# EAGLE schematic board1 (EAGLE 9.0.0)
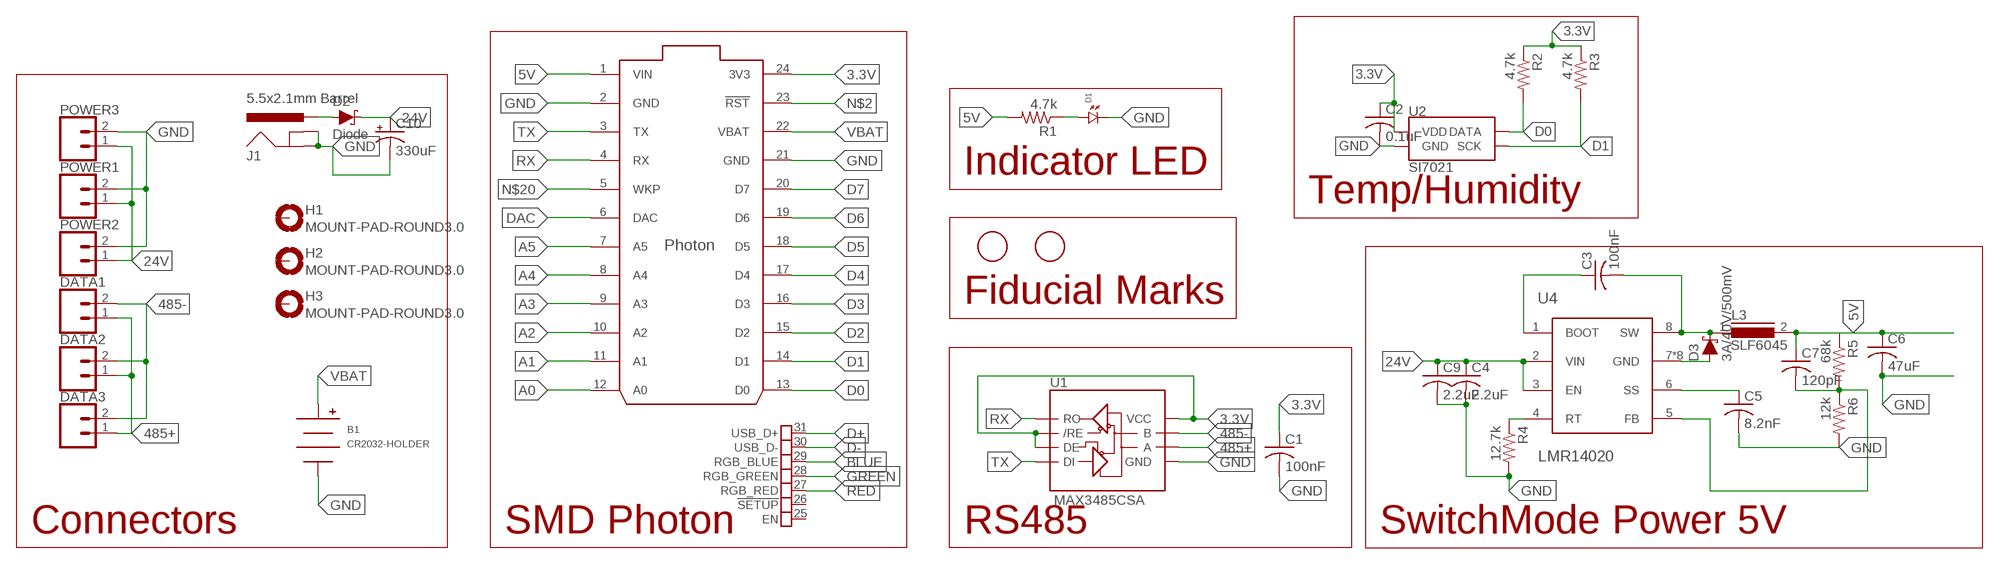
[diagram p0: schematic, sheet 1]

## Parts
B1  CR2032-HOLDER  [CH28-2032LF]
C1  100nF  C-USC0805  [C0805]
C2  0.1uF  C-USC0805  [C0805]
C3  100nF  C-USC0805  [C0805]
C4  2.2uF  C-USC0805  [C0805]
C5  8.2nF  C-USC0805  [C0805]
C6  47uF  C-USC0805  [C0805]
C7  120pF  C-USC0805  [C0805]
C9  2.2uF  C-USC0805  [C0805]
C10  330uF  CPOL-US175TMP-0808  [175TMP-0808]
D1  LED.0805  [0805.LED]
D2  Diode  DIODE-SCHOTTKY-B340A  [SMA-DIODE]
D3  3A/40V/500mV  DIODE-SCHOTTKY-B340A  [SMA-DIODE]
DATA1  CONN_025MM  [SCREWTERMINAL-5MM-2]
DATA2  CONN_025MM  [SCREWTERMINAL-5MM-2]
DATA3  CONN_025MM  [SCREWTERMINAL-5MM-2]
FID1  FIDUCIAL  [FIDUCIAL_1MM]
FID2  FIDUCIAL  [FIDUCIAL_1MM]
H1  MOUNT-PAD-ROUND3.0  [3,0-PAD]
H2  MOUNT-PAD-ROUND3.0  [3,0-PAD]
H3  MOUNT-PAD-ROUND3.0  [3,0-PAD]
J1  5.5x2.1mm Barrel  POWER_JACKSMD  [POWER_JACK_SMD]
L3  SLF6045  SLF7045  [SLF7045]
POWER1  CONN_025MM  [SCREWTERMINAL-5MM-2]
POWER2  CONN_025MM  [SCREWTERMINAL-5MM-2]
POWER3  CONN_025MM  [SCREWTERMINAL-5MM-2]
R1  4.7k  R-US_R0805  [R0805]
R2  4.7k  R-US_R0805  [R0805]
R3  4.7k  R-US_R0805  [R0805]
R4  12.7k  R-US_R0805  [R0805]
R5  68k  R-US_R0805  [R0805]
R6  12k  R-US_R0805  [R0805]
U1  MAX3485CSA  RS485SOIC  [SO08]
U2  SI7021  [DFN-6-3X3-SI7021]
U3  PHOTON  PHOTON_SMD  [PHOTON_SMD]
U4  LMR14020  [SOIC8]

## Nets
3.3V: C1.1 C2.1 R2.1 R3.1 U1.2(/RE) U1.3(DE) U1.8(VCC) U2.VDD U3.24(3V3)
5V: C6.1 C7.1 L3.2 R1.2 R5.1 U3.1(VIN)
24V: C4.1 C9.1 C10.+ D2.C POWER1.1 POWER2.1 POWER3.1 U4.2(VIN) U4.3(EN)
485+: DATA1.1 DATA2.1 DATA3.1 U1.6(A)
485-: DATA1.2 DATA2.2 DATA3.2 U1.7(B)
A0: U3.12(A0)
A1: U3.11(A1)
A2: U3.10(A2)
A3: U3.9(A3)
A4: U3.8(A4)
A5: U3.7(A5)
BLUE: U3.29(RGB_BLUE)
D0: R2.2 U2.DATA U3.13(D0)
D1: R3.2 U2.SCK U3.14(D1)
D2: U3.15(D2)
D3: U3.16(D3)
D4: U3.17(D4)
D5: U3.18(D5)
D6: U3.19(D6)
D7: U3.20(D7)
D+: U3.31(USB_D+)
D-: U3.30(USB_D-)
DAC: U3.6(DAC)
FB: C7.2 R5.2 R6.1 U4.5(FB)
GND: B1.NEG C1.2 C2.2 C4.2 C5.2 C6.2 C9.2 C10.- D1.P$2 D3.A J1.GND(GNDBREAK) J1.P$4(GND) POWER1.2 POWER2.2 POWER3.2 R4.2 R6.2 U1.5(GND) U2.GND U3.2(GND) U3.21(GND) U4.7(GND) U4.GND@1(GND) U4.GND@2(GND) U4.GND@3(GND) U4.GND@4(GND) U4.GND@5(GND) U4.GND@6(GND) U4.GND@7(GND)
GREEN: U3.28(RGB_GREEN)
N$1: D1.P$1 R1.1
N$2: U3.23(!RST)
N$5: C3.1 U4.1(BOOT)
N$6: R4.1 U4.4(RT)
N$7: C5.1 U4.6(SS)
N$20: U3.5(WKP)
RED: U3.27(RGB_RED)
RX: U1.1(RO) U3.4(RX)
SW: C3.2 D3.C L3.1 U4.8(SW)
TX: U1.4(DI) U3.3(TX)
VBAT: B1.POS U3.22(VBAT)
VIN: D2.A J1.VIN0(PWR)
Unconnected: H1.B3,0(MOUNT) H2.B3,0(MOUNT) H3.B3,0(MOUNT) U3.25(EN) U3.26(!SETUP)

## Notes on the sheet
- Indicator LED
- Temp/Humidity
- Fiducial Marks
- Connectors | SMD Photon | RS485 | SwitchMode Power 5V

## Library data of the parts
B1 = battery-holder:CR2032-HOLDER
C1-C7 C9 = rcl:C-US: CAPACITOR, American symbol
C10 = rcl:CPOL-US: POLARIZED CAPACITOR, American symbol
D1 = standardparts:LED
D2 = SparkFun-DiscreteSemi:DIODE-SCHOTTKY: Schottky diode A Schottky diode is a semiconductor diode which has a low forward voltage drop and a very fast switching action.; PROD_ID: DIO-09886; VALUE: 3A/40V/500mV
D3 = SparkFun-DiscreteSemi:DIODE-SCHOTTKY: Schottky diode A Schottky diode is a semiconductor diode which has a low forward voltage drop and a very fast switching action.; PROD_ID: DIO-09886
DATA1-DATA3 POWER1-POWER3 = SparkFun-Connectors:CONN_02: Multi connection point. Often used as Generic Header-pin footprint for 0.1 inch spaced/style header connections On any of the 0.1 inch spaced packages, you can populate with these: Break Away Headers - Straight <https://www.sparkfun.com/products/116> (PRT-00116) Break Away Male Headers - Right Angle <https://www.sparkfun.com/products/553> (PRT-00553) Female Headers <https://www.sparkfun.com/products/115> (PRT-00115) Break Away Headers - Machine Pin <https://www.sparkfun.com/products/117> (PRT-00117) Break Away Female Headers - Swiss Machine Pin <https://www.sparkfun.com/products/743> (PRT-00743) For SCREWTERMINALS and SPRING TERMINALS visit here: Screw Terimnals on SparkFun.com <https://www.sparkfun.com/search/results?term=Screw+Terminals> (5mm/3.5mm/2.54mm spacing) This device is also useful as a general connection point to wire up your design to another part of your project. Our various solder wires solder well into these plated through hole pads. Hook-Up Wire - Assortment (Stranded, 22 AWG) <https://www.sparkfun.com/products/11375> (PRT-11375) Hook-Up Wire - Assortment (Solid Core, 22 AWG) <https://www.sparkfun.com/products/11367> (PRT-11367) View the entire wire category on our website here <https://www.sparkfun.com/categories/141> Special notes: Molex polarized connector foot print use with: PRT-08233 with associated crimp pins and housings. 2.54_SCREWTERM for use with PRT-10571. 3.5mm Screw Terminal footprints for PRT-08084 5mm Screw Terminal footprints for use with PRT-08432; SF_SKU: PRT-08432
FID1 FID2 = adafruit:FIDUCIAL: For use by pick and place machines to calibrate the vision/machine, 1mm By microbuilder.eu
H1-H3 = holes:MOUNT-PAD-ROUND: MOUNTING PAD, round
J1 = SparkFun-Connectors:POWER_JACK: Power Jack Connector This is the standard 5.5mm barrel jack for power. The PTH is the most common, proven, reliable, footprint. The Slot footprint only works if the mill layer is transmitted to the PCB fab house so be warned. Here are the connectors we sell at SparkFun: DC Barrel Power Jack/Connector <https://www.sparkfun.com/products/119> (PRT-00119) DC Barrel Power Jack/Connector (SMD) <https://www.sparkfun.com/products/12748> (PRT-12748) DC Barrel Jack Adapter - Breadboard Compatible <https://www.sparkfun.com/products/10811> (PRT-10811) It is used on this SparkFun product (and many, many others): SparkFun RedBoard - Programmed with Arduino <https://www.sparkfun.com/products/12757> (DEV-12757) Also, if you need a mating power supply or connector, please check these out: Wall Adapter Power Supply - 9VDC 650mA <https://www.sparkfun.com/products/298> (TOL-00298) DC Barrel Jack Adapter - Male <https://www.sparkfun.com/products/10287> (PRT-10287); PROD_ID: CONN-08106; SF_ID: PRT-12748
L3 = inductors:SLF7045: SMD Inductors(Coils) For Power Line (Wound, Magnetic Shielded) Source: TDK, e531_slf7045.pdf
R1-R6 = rcl:R-US_: RESISTOR, American symbol
U1 = SparkFun-IC-Comms:RS485: RS-485 Transceiver SP3485 Series 8 Pin NSOIC 3.3 V Low Power Half Duplex RS-485 Transceiver MAX3485 compatible Datasheet <http://www.sparkfun.com/datasheets/Components/General/sp3485CN-LTR.pdf> SparkFun Products SparkFun Transceiver Breakout - RS-485 <https://www.sparkfun.com/products/10124> (BOB-10124) SparkFun USB to RS-485 Converter <https://www.sparkfun.com/products/9822> (BOB-09822); PROD_ID: IC-09388
U2 = SparkFun-Sensors:SI7021: Silicon Labs Si7021 I2C Humidity and Temperature Sensor The Si7021 is a low-cost, easy-to-use, highly accurate, digital humidity and temperature sensor. This sensor is ideal for environmental sensing and data logging and perfect for build a weather stations or humidor control system. All you need are two lines for I2C communication, and you’ll have relative humidity readings and very accurate temperature readings as a bonus! Datasheet <https://cdn.sparkfun.com/datasheets/Sensors/Weather/Si7021.pdf> SparkFun Products SparkFun Humidity and Temperature Sensor Breakout - Si7021 <https://www.sparkfun.com/products/13763> (SEN-13763) SparkFun Blynk Board - ESP8266 <https://www.sparkfun.com/products/13794> (WRL-13794); PROD_ID: IC-13093
U3 = Spark:PHOTON_SMD: Photon (without headers) - designed to be surface mounted with 7 extra exposed pads on the bottom of the board which include, 3 RGB LED outputs, /SETUP, EN (3.3V SMPS enable input), USB D+ and USB D-.
U4 = ref-packages:LMR14020